# EAGLE schematic FM-Superregenerative-Receiver-1 (EAGLE 7.6.0)
Elektor FM Broadcast Super-Regenerative Receiver Burkhard Kainka's super-regenerative FM receiver from Elektor September 2007. http://www.vk2zay.net/article/195 http://siva666siva.webs.com/FM.PDF
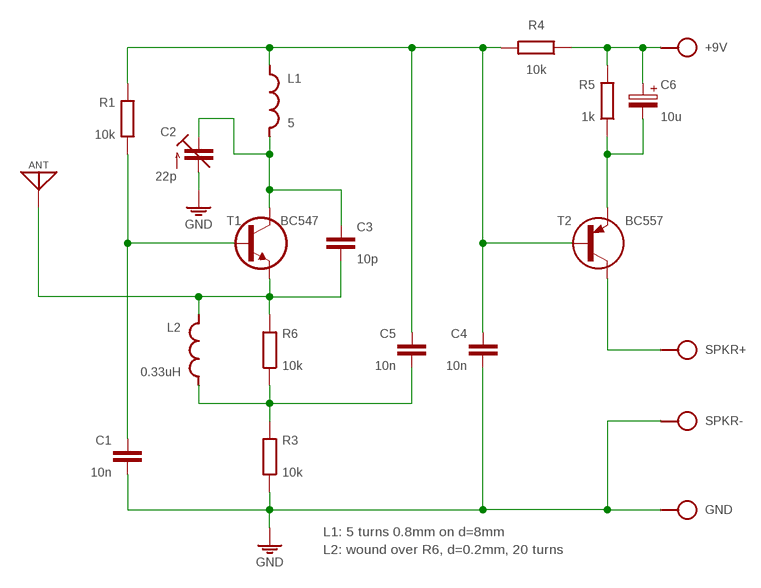
[diagram p0: schematic, sheet 1]

## Parts
+9V  SPAD  [SPAD]
ANT  ANT  [SPAD]
C1  10n  C050-020X036  [C050-020X036]
C2  22p  C-TR-PH201272222-808-2PINB  [TRIM-2222-808]
C3  10p  C050-020X036  [C050-020X036]
C4  10n  C050-020X036/V  [C050-020X036/V]
C5  10n  C050-020X036/V  [C050-020X036/V]
C6  10u  CPOLE2,5-3  [E2,5-3]
GND  SPAD  [SPAD]
L1  5  L-SHORTL-04/7V-X  [L-04/7V-X]
L2  0.33uH  L-SHORTL-04/7V-X  [L-04/7V-X]
R1  10k  R0202/7  [0202/7]
R3  10k  R0202V  [0202V]
R4  10k  R0202/7  [0202/7]
R5  1k  R0202/7-V  [0202/7-V]
R6  10k  R0202/7-V  [0202/7-V]
SPKR+  SPAD  [SPAD]
SPKR-  SPAD  [SPAD]
T1  BC547  BC547CBE  [TO92-CBE]
T2  BC557  BC557CBE-A  [TO92-CBE-A]

## Nets
GND: C1.2 C2.2(A) C4.2 GND.1 R3.1 SPKR-.1
N$1: C1.1 R1.1 T1.B
N$2: C6.- R5.1 T2.E
N$3: C5.2 L2.1 R3.2 R6.1
N$4: ANT.1 C3.2 L2.2 R6.2 T1.E
N$5: C4.1 C5.1 L1.2 R1.2 R4.2 T2.B
N$7: +9V.1 C6.+ R4.1 R5.2
N$8: SPKR+.1 T2.C
N$9: C2.3(E) C3.1 L1.1 T1.C

## Notes on the sheet
- L1: 5 turns 0.8mm on d=8mm
- L2: wound over R6, d=0.2mm, 20 turns

## Library data of the parts
+9V GND SPKR+ SPKR- = pad:SPAD
ANT = pad:ANT
C1 C3-C5 = c:C: CAPACITOR, European symbol
C2 = cap-trim:C-TR-PH20127
C6 = c:CPOL: POLARIZED CAPACITOR, European symbol
L1 L2 = l:L-SHORT
R1 R3-R6 = r:R: RESISTOR, European symbol
T1 = t:BC547
T2 = t:BC557

## Net classes
0 default: width 0.61 mm